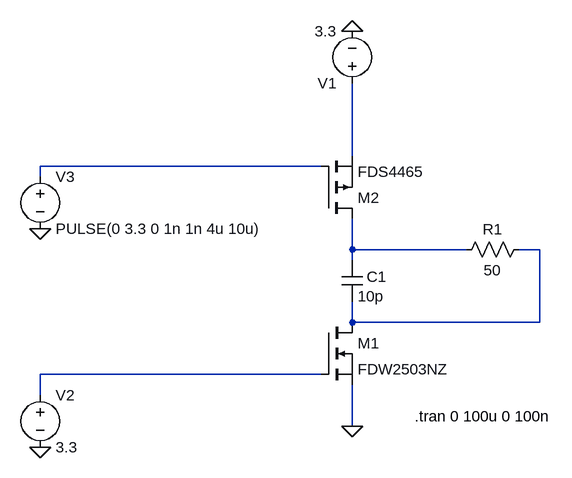
[diagram p0: schematic switchedC.asc]
switchedC.asc, the LTspice schematic file:
Version 4
SHEET 1 880 680
WIRE 416 32 416 -80
WIRE 368 48 -64 48
WIRE -64 64 -64 48
WIRE 416 176 416 128
WIRE 592 176 416 176
WIRE 704 176 672 176
WIRE 416 192 416 176
WIRE 416 288 416 256
WIRE 704 288 704 176
WIRE 704 288 416 288
WIRE 368 368 -64 368
WIRE -64 400 -64 368
WIRE 416 448 416 384
FLAG 416 448 0
FLAG 416 -160 0
FLAG -64 480 0
FLAG -64 144 0
SYMBOL cap 400 192 R0
WINDOW 0 38 26 Left 2
SYMATTR InstName C1
SYMATTR Value 10p
SYMBOL voltage 416 -64 R180
WINDOW 123 0 0 Left 0
WINDOW 39 0 0 Left 0
SYMATTR InstName V1
SYMATTR Value 3.3
SYMBOL voltage -64 384 R0
WINDOW 123 0 0 Left 0
WINDOW 39 0 0 Left 0
SYMATTR InstName V2
SYMATTR Value 3.3
SYMBOL voltage -64 48 R0
WINDOW 123 0 0 Left 0
WINDOW 39 0 0 Left 0
SYMATTR InstName V3
SYMATTR Value PULSE(0 3.3 0 1n 1n 4u 10u)
SYMBOL res 688 160 R90
WINDOW 0 0 56 VBottom 2
WINDOW 3 32 56 VTop 2
SYMATTR InstName R1
SYMATTR Value 50
SYMBOL nmos 368 288 R0
SYMATTR InstName M1
SYMATTR Value FDW2503NZ
SYMBOL pmos 368 128 M180
SYMATTR InstName M2
SYMATTR Value FDS4465
TEXT 512 432 Left 2 !.tran 0 100u 0 100n

The netlist it stands for:
* switchedC.asc
C1 N003 N004 10p
V1 N001 0 3.3
V2 N005 0 3.3
V3 N002 0 PULSE(0 3.3 0 1n 1n 4u 10u)
R1 N004 N003 50
M1 N004 N005 0 0 FDW2503NZ
M2 N003 N002 N001 N001 FDS4465
.model NMOS NMOS
.model PMOS PMOS
.lib standard.mos
.tran 0 100u 0 100n
.backanno
.end